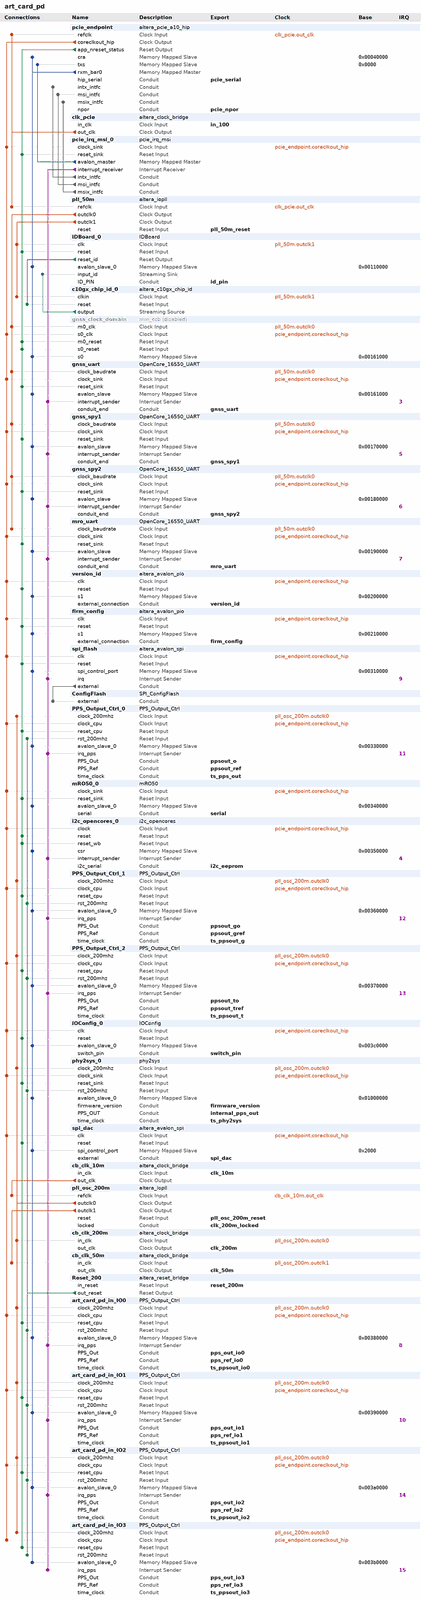
[diagram p0: system contents, whole]
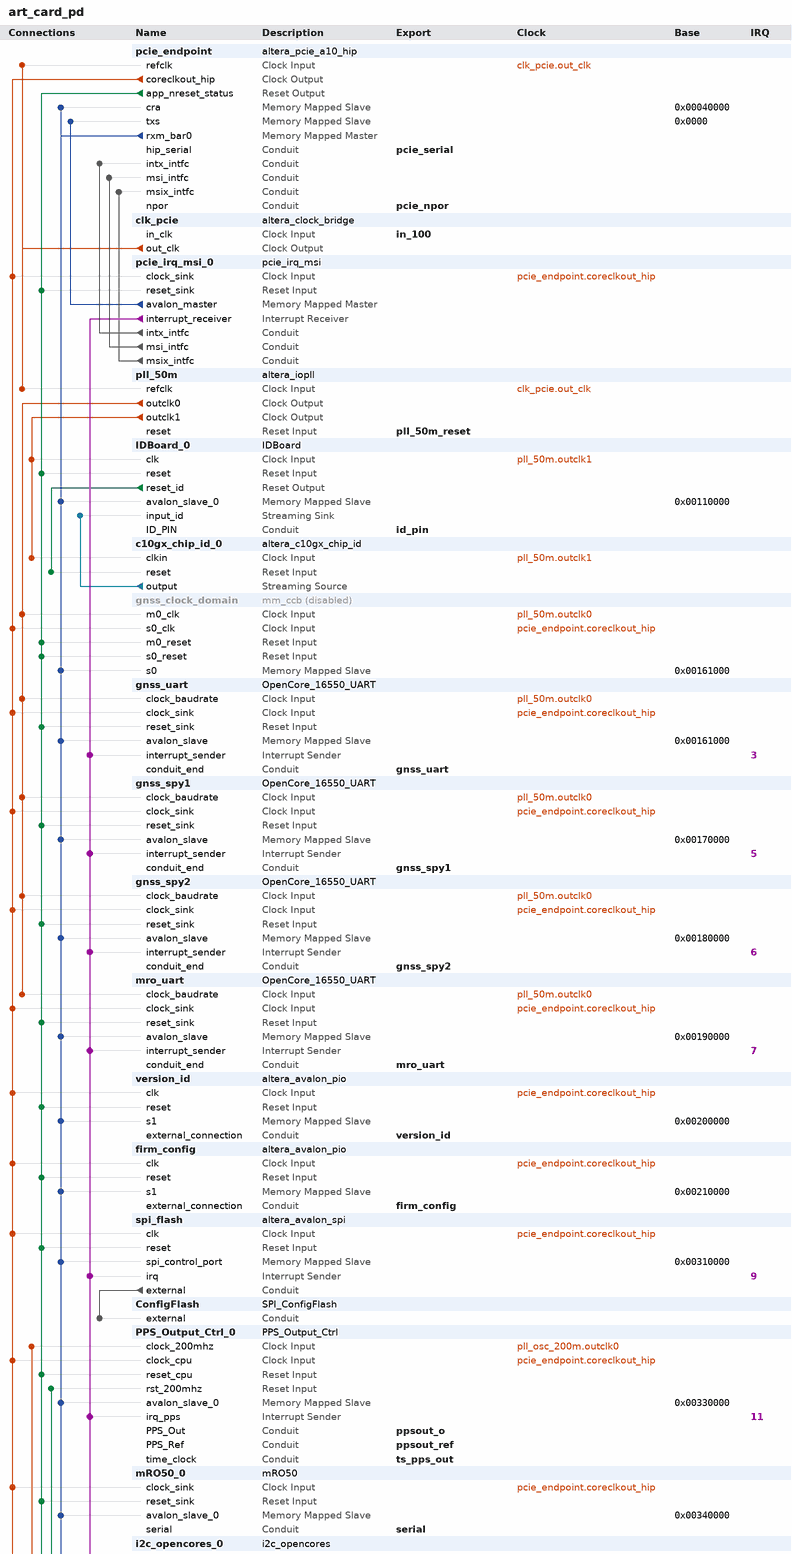
[diagram p1: system contents, upper part]
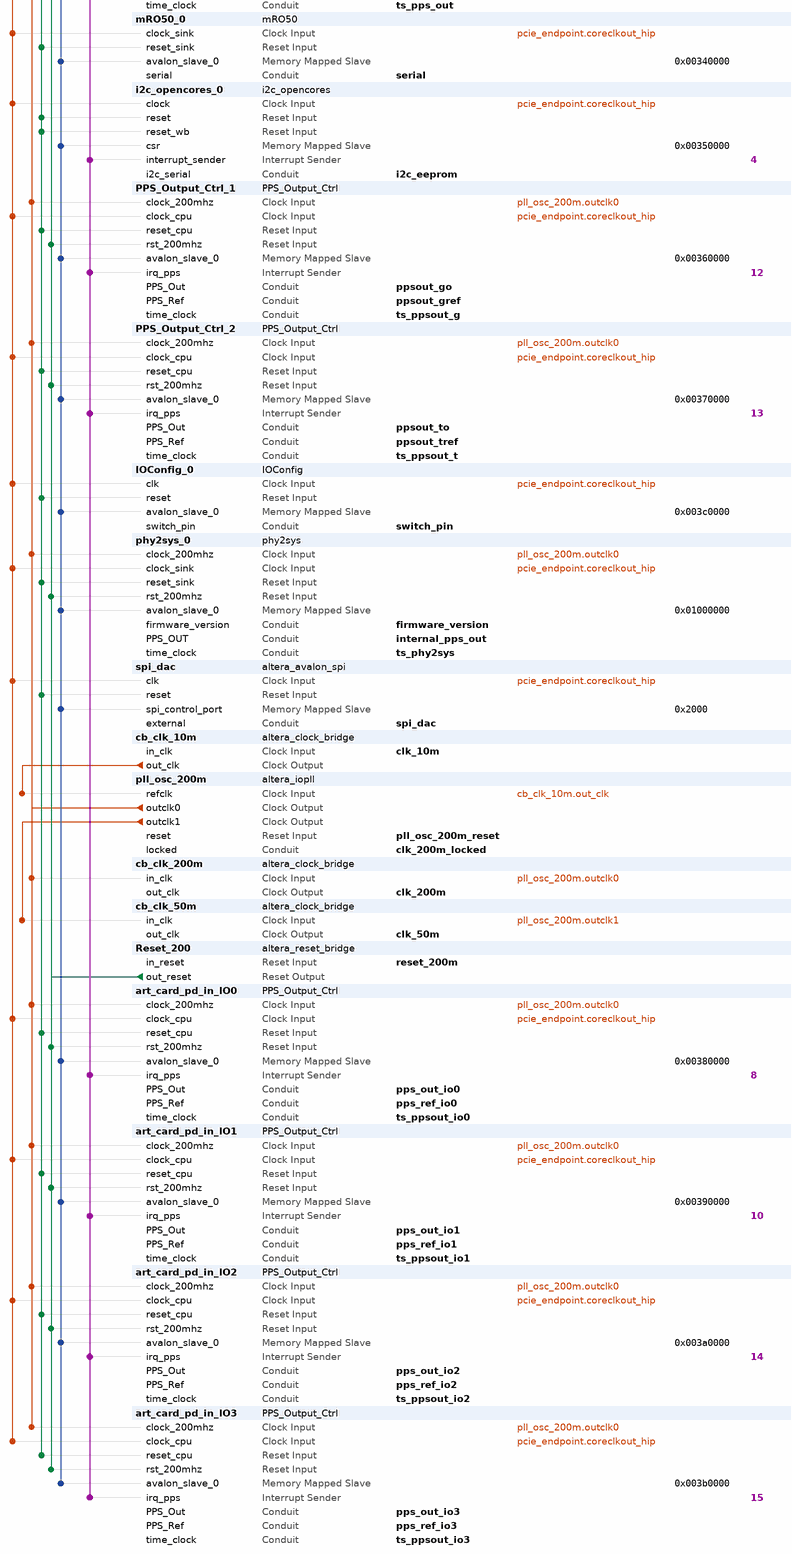
[diagram p2: system contents, lower part]
# Platform Designer (Qsys) system art_card_pd, Cyclone 10 GX 10CX220YF672I5G
# Parameters at their usual value, and those the tool derives, are not listed.
package require -exact qsys 1.0
create_system art_card_pd
set_project_property DEVICE_FAMILY {Cyclone 10 GX}
set_project_property DEVICE 10CX220YF672I5G

add_component pcie_endpoint ip/art_card_pd/art_card_pd_pcie_a10_hip_0.ip altera_pcie_a10_hip pcie_endpoint 20.1.0
load_component pcie_endpoint
set_component_parameter_value interface_type_hwtcl Avalon-MM
set_component_parameter_value force_tag_checking_on_hwtcl 0
set_component_parameter_value wrala_hwtcl 4
set_component_parameter_value device_family {Cyclone 10 GX}
set_component_parameter_value base_device NIGHTFURY1
set_component_parameter_value part_trait_device 10CX220YF672I5G
set_component_parameter_value avmm_addr_width_hwtcl 64
set_component_parameter_value cg_enable_advanced_interrupt_hwtcl 1
set_component_parameter_value cg_enable_a2p_interrupt_hwtcl 0
set_component_parameter_value enable_hip_status_for_avmm_hwtcl 0
set_component_parameter_value internal_controller_hwtcl 1
set_component_parameter_value enable_rxm_burst_hwtcl 0
set_component_parameter_value extended_tag_support_hwtcl 0
set_component_parameter_value user_txs_addr_width_hwtcl 32
set_component_parameter_value cg_a2p_addr_map_pass_thru_bits_hwtcl 12
set_component_parameter_value rx_buffer_credit_alloc_hwtcl Balanced
set_component_parameter_value rx_cred_ctl_param_hwtcl 0
set_component_parameter_value enable_avst_reset_hwtcl 1
set_component_parameter_value cseb_config_bypass_gui_hwtcl 0
set_component_parameter_value cseb_autonomous_hwtcl 0
set_component_parameter_value speed_change_hwtcl 0
set_component_parameter_value xcvr_reconfig_hwtcl 0
set_component_parameter_value export_fpll_output_to_top_level_hwtcl 0
set_component_parameter_value export_phy_input_to_top_level_hwtcl 0
set_component_parameter_value enable_lmi_hwtcl 0
set_component_parameter_value adme_enable_hwtcl 0
set_component_parameter_value enable_devkit_conduit_hwtcl 0
set_component_parameter_value enable_skp_det 0
set_component_parameter_value dis_adapt 0
set_component_parameter_value enable_msft_pipen1b_hwtcl 0
set_component_parameter_value DEBUG_WIDTH 16
set_component_parameter_value enable_ppm_detector_settings_hwtcl 0
set_component_parameter_value select_design_example_hwtcl PIO
set_component_parameter_value enable_example_design_qii_hwtcl 1
set_component_parameter_value enable_example_design_sim_hwtcl 1
set_component_parameter_value enable_g3_bypass_equlz_rp_sim_hwtcl 0
set_component_parameter_value enable_example_design_synth_hwtcl 1
set_component_parameter_value enable_example_design_tb_hwtcl 1
set_component_parameter_value apps_type_hwtcl 0
set_component_parameter_value select_design_example_rtl_lang_hwtcl Verilog
set_component_parameter_value targeted_devkit_hwtcl {Arria 10 GX FPGA Development Kit}
set_component_parameter_value bar0_type_hwtcl {32-bit non-prefetchable memory}
set_component_parameter_value bar0_address_width_hwtcl 16
set_component_parameter_value bar1_type_hwtcl Disabled
set_component_parameter_value bar1_address_width_hwtcl 0
set_component_parameter_value bar2_type_hwtcl Disabled
set_component_parameter_value bar2_address_width_hwtcl 8
set_component_parameter_value bar3_type_hwtcl Disabled
set_component_parameter_value bar3_address_width_hwtcl 0
set_component_parameter_value eco_fb332688_dis_hwtcl 0
set_component_parameter_value vendor_id_hwtcl 6871
set_component_parameter_value device_id_hwtcl 40960
set_component_parameter_value pf0_vf_device_id_hwtcl 0
set_component_parameter_value revision_id_hwtcl 5
set_component_parameter_value class_code_hwtcl 16711680
set_component_parameter_value pf0_subclass_code_hwtcl 0
set_component_parameter_value pf0_pci_prog_intfc_byte_hwtcl 0
set_component_parameter_value subsystem_vendor_id_hwtcl 6871
set_component_parameter_value subsystem_device_id_hwtcl 40960
set_component_parameter_value pf0_vf_subsystem_device_id_hwtcl 0
set_component_parameter_value maximum_payload_size_hwtcl 128
set_component_parameter_value completion_timeout_hwtcl ABCD
set_component_parameter_value advance_error_reporting_hwtcl 0
set_component_parameter_value ecrc_check_capable_hwtcl 0
set_component_parameter_value ecrc_gen_capable_hwtcl 0
set_component_parameter_value slot_clock_cfg_hwtcl 1
set_component_parameter_value msi_multi_message_capable_hwtcl 16
set_component_parameter_value vsec_id_hwtcl 6871
set_component_parameter_value vsec_cap_hwtcl 0
set_component_parameter_value user_id_hwtcl 0
set_component_parameter_value msix_table_size_hwtcl 3
set_component_parameter_value msix_table_bir_hwtcl 3
set_component_parameter_value msix_pba_offset_hwtcl 8192
set_component_parameter_value msix_pba_bir_hwtcl 3
set_component_parameter_value gen3_coeff_1_hwtcl 8
set_component_parameter_value bfm_drive_interface_clk_hwtcl 1
set_component_parameter_value bfm_drive_interface_npor_hwtcl 1
set_component_parameter_value bfm_drive_interface_pipe_hwtcl 1
set_component_parameter_value bfm_drive_interface_control_hwtcl 1
set_component_parameter_value reserved_debug_hwtcl 0
set_component_parameter_value sriov2_en 1
set_component_parameter_value virtio_visible 0
set_component_parameter_value enable_nobar_slection_hwtcl 0
set_component_parameter_value enable_custom_features_hwtcl 0
set_component_parameter_value pf0_extra_bar_present_hwtcl 0
set_component_parameter_value pf0_extra_bar_size_hwtcl 12
set_component_parameter_value devhide_support_hwtcl 0
set_component_parameter_value device_embedded_ep_support_hwtcl 0
set_component_parameter_value total_pf_count_hwtcl 1
set_component_parameter_value pf0_vf_count_user_hwtcl 0
set_component_parameter_value pf1_vf_count_user_hwtcl 0
set_component_parameter_value pf2_vf_count_user_hwtcl 0
set_component_parameter_value pf3_vf_count_user_hwtcl 0
set_component_parameter_value system_page_sizes_supported_hwtcl 1363
set_component_parameter_value sr_iov_support_hwtcl 0
set_component_parameter_value include_virtio_capabilities_hwtcl 0
set_component_parameter_value enable_alternate_link_list_hwtcl 0
set_component_parameter_value ari_support_hwtcl 0
set_component_parameter_value flr_capability_user_hwtcl 0
set_component_parameter_value pf0_virtio_capability_present_hwtcl 0
set_component_parameter_value pf0_virtio_device_specific_cap_present_hwtcl 0
set_component_parameter_value pf0_virtio_cmn_config_bar_indicator_hwtcl 0
set_component_parameter_value pf0_virtio_cmn_config_bar_offset_hwtcl 0
set_component_parameter_value pf0_virtio_cmn_config_structure_length_hwtcl 0
set_component_parameter_value pf0_virtio_notification_bar_indicator_hwtcl 0
set_component_parameter_value pf0_virtio_notification_bar_offset_hwtcl 0
set_component_parameter_value pf0_virtio_notification_structure_length_hwtcl 0
set_component_parameter_value pf0_virtio_notify_off_multiplier_hwtcl 0
set_component_parameter_value pf0_virtio_isrstatus_bar_indicator_hwtcl 0
set_component_parameter_value pf0_virtio_isrstatus_bar_offset_hwtcl 0
set_component_parameter_value pf0_virtio_isrstatus_structure_length_hwtcl 0
set_component_parameter_value pf0_virtio_devspecific_bar_indicator_hwtcl 0
set_component_parameter_value pf0_virtio_devspecific_bar_offset_hwtcl 0
set_component_parameter_value pf0_virtio_devspecific_structure_length_hwtcl 0
set_component_parameter_value pf0_virtio_pciconfig_access_bar_indicator_hwtcl 0
set_component_parameter_value pf0_virtio_pciconfig_access_bar_offset_hwtcl 0
set_component_parameter_value pf0_virtio_pciconfig_access_structure_length_hwtcl 0
set_component_parameter_value pf1_virtio_capability_present_hwtcl 0
set_component_parameter_value pf1_virtio_device_specific_cap_present_hwtcl 0
set_component_parameter_value pf1_virtio_cmn_config_bar_indicator_hwtcl 0
set_component_parameter_value pf1_virtio_cmn_config_bar_offset_hwtcl 0
set_component_parameter_value pf1_virtio_cmn_config_structure_length_hwtcl 0
set_component_parameter_value pf1_virtio_notification_bar_indicator_hwtcl 0
set_component_parameter_value pf1_virtio_notification_bar_offset_hwtcl 0
set_component_parameter_value pf1_virtio_notification_structure_length_hwtcl 0
set_component_parameter_value pf1_virtio_notify_off_multiplier_hwtcl 0
set_component_parameter_value pf1_virtio_isrstatus_bar_indicator_hwtcl 0
set_component_parameter_value pf1_virtio_isrstatus_bar_offset_hwtcl 0
set_component_parameter_value pf1_virtio_isrstatus_structure_length_hwtcl 0
set_component_parameter_value pf1_virtio_devspecific_bar_indicator_hwtcl 0
set_component_parameter_value pf1_virtio_devspecific_bar_offset_hwtcl 0
set_component_parameter_value pf1_virtio_devspecific_structure_length_hwtcl 0
set_component_parameter_value pf1_virtio_pciconfig_access_bar_indicator_hwtcl 0
set_component_parameter_value pf1_virtio_pciconfig_access_bar_offset_hwtcl 0
set_component_parameter_value pf1_virtio_pciconfig_access_structure_length_hwtcl 0
set_component_parameter_value pf2_virtio_capability_present_hwtcl 0
set_component_parameter_value pf2_virtio_device_specific_cap_present_hwtcl 0
set_component_parameter_value pf2_virtio_cmn_config_bar_indicator_hwtcl 0
set_component_parameter_value pf2_virtio_cmn_config_bar_offset_hwtcl 0
set_component_parameter_value pf2_virtio_cmn_config_structure_length_hwtcl 0
set_component_parameter_value pf2_virtio_notification_bar_indicator_hwtcl 0
set_component_parameter_value pf2_virtio_notification_bar_offset_hwtcl 0
set_component_parameter_value pf2_virtio_notification_structure_length_hwtcl 0
set_component_parameter_value pf2_virtio_notify_off_multiplier_hwtcl 0
set_component_parameter_value pf2_virtio_isrstatus_bar_indicator_hwtcl 0
set_component_parameter_value pf2_virtio_isrstatus_bar_offset_hwtcl 0
set_component_parameter_value pf2_virtio_isrstatus_structure_length_hwtcl 0
set_component_parameter_value pf2_virtio_devspecific_bar_indicator_hwtcl 0
set_component_parameter_value pf2_virtio_devspecific_bar_offset_hwtcl 0
set_component_parameter_value pf2_virtio_devspecific_structure_length_hwtcl 0
set_component_parameter_value pf2_virtio_pciconfig_access_bar_indicator_hwtcl 0
set_component_parameter_value pf2_virtio_pciconfig_access_bar_offset_hwtcl 0
set_component_parameter_value pf2_virtio_pciconfig_access_structure_length_hwtcl 0
set_component_parameter_value pf3_virtio_capability_present_hwtcl 0
set_component_parameter_value pf3_virtio_device_specific_cap_present_hwtcl 0
set_component_parameter_value pf3_virtio_cmn_config_bar_indicator_hwtcl 0
set_component_parameter_value pf3_virtio_cmn_config_bar_offset_hwtcl 0
set_component_parameter_value pf3_virtio_cmn_config_structure_length_hwtcl 0
set_component_parameter_value pf3_virtio_notification_bar_indicator_hwtcl 0
set_component_parameter_value pf3_virtio_notification_bar_offset_hwtcl 0
set_component_parameter_value pf3_virtio_notification_structure_length_hwtcl 0
set_component_parameter_value pf3_virtio_notify_off_multiplier_hwtcl 0
set_component_parameter_value pf3_virtio_isrstatus_bar_indicator_hwtcl 0
set_component_parameter_value pf3_virtio_isrstatus_bar_offset_hwtcl 0
set_component_parameter_value pf3_virtio_isrstatus_structure_length_hwtcl 0
set_component_parameter_value pf3_virtio_devspecific_bar_indicator_hwtcl 0
set_component_parameter_value pf3_virtio_devspecific_bar_offset_hwtcl 0
set_component_parameter_value pf3_virtio_devspecific_structure_length_hwtcl 0
set_component_parameter_value pf3_virtio_pciconfig_access_bar_indicator_hwtcl 0
set_component_parameter_value pf3_virtio_pciconfig_access_bar_offset_hwtcl 0
set_component_parameter_value pf3_virtio_pciconfig_access_structure_length_hwtcl 0
set_component_parameter_value pf4_virtio_capability_present_hwtcl 0
set_component_parameter_value pf4_virtio_device_specific_cap_present_hwtcl 0
set_component_parameter_value pf4_virtio_cmn_config_bar_indicator_hwtcl 0
set_component_parameter_value pf4_virtio_cmn_config_bar_offset_hwtcl 0
set_component_parameter_value pf4_virtio_cmn_config_structure_length_hwtcl 0
set_component_parameter_value pf4_virtio_notification_bar_indicator_hwtcl 0
set_component_parameter_value pf4_virtio_notification_bar_offset_hwtcl 0
set_component_parameter_value pf4_virtio_notification_structure_length_hwtcl 0
set_component_parameter_value pf4_virtio_notify_off_multiplier_hwtcl 0
set_component_parameter_value pf4_virtio_isrstatus_bar_indicator_hwtcl 0
set_component_parameter_value pf4_virtio_isrstatus_bar_offset_hwtcl 0
set_component_parameter_value pf4_virtio_isrstatus_structure_length_hwtcl 0
set_component_parameter_value pf4_virtio_devspecific_bar_indicator_hwtcl 0
set_component_parameter_value pf4_virtio_devspecific_bar_offset_hwtcl 0
set_component_parameter_value pf4_virtio_devspecific_structure_length_hwtcl 0
set_component_parameter_value pf4_virtio_pciconfig_access_bar_indicator_hwtcl 0
set_component_parameter_value pf4_virtio_pciconfig_access_bar_offset_hwtcl 0
set_component_parameter_value pf4_virtio_pciconfig_access_structure_length_hwtcl 0
set_component_parameter_value pf5_virtio_capability_present_hwtcl 0
set_component_parameter_value pf5_virtio_device_specific_cap_present_hwtcl 0
set_component_parameter_value pf5_virtio_cmn_config_bar_indicator_hwtcl 0
set_component_parameter_value pf5_virtio_cmn_config_bar_offset_hwtcl 0
set_component_parameter_value pf5_virtio_cmn_config_structure_length_hwtcl 0
set_component_parameter_value pf5_virtio_notification_bar_indicator_hwtcl 0
set_component_parameter_value pf5_virtio_notification_bar_offset_hwtcl 0
set_component_parameter_value pf5_virtio_notification_structure_length_hwtcl 0
set_component_parameter_value pf5_virtio_notify_off_multiplier_hwtcl 0
set_component_parameter_value pf5_virtio_isrstatus_bar_indicator_hwtcl 0
set_component_parameter_value pf5_virtio_isrstatus_bar_offset_hwtcl 0
set_component_parameter_value pf5_virtio_isrstatus_structure_length_hwtcl 0
set_component_parameter_value pf5_virtio_devspecific_bar_indicator_hwtcl 0
set_component_parameter_value pf5_virtio_devspecific_bar_offset_hwtcl 0
set_component_parameter_value pf5_virtio_devspecific_structure_length_hwtcl 0
set_component_parameter_value pf5_virtio_pciconfig_access_bar_indicator_hwtcl 0
set_component_parameter_value pf5_virtio_pciconfig_access_bar_offset_hwtcl 0
set_component_parameter_value pf5_virtio_pciconfig_access_structure_length_hwtcl 0
set_component_parameter_value pf6_virtio_capability_present_hwtcl 0
set_component_parameter_value pf6_virtio_device_specific_cap_present_hwtcl 0
set_component_parameter_value pf6_virtio_cmn_config_bar_indicator_hwtcl 0
set_component_parameter_value pf6_virtio_cmn_config_bar_offset_hwtcl 0
set_component_parameter_value pf6_virtio_cmn_config_structure_length_hwtcl 0
set_component_parameter_value pf6_virtio_notification_bar_indicator_hwtcl 0
set_component_parameter_value pf6_virtio_notification_bar_offset_hwtcl 0
set_component_parameter_value pf6_virtio_notification_structure_length_hwtcl 0
set_component_parameter_value pf6_virtio_notify_off_multiplier_hwtcl 0
set_component_parameter_value pf6_virtio_isrstatus_bar_indicator_hwtcl 0
set_component_parameter_value pf6_virtio_isrstatus_bar_offset_hwtcl 0
set_component_parameter_value pf6_virtio_isrstatus_structure_length_hwtcl 0
set_component_parameter_value pf6_virtio_devspecific_bar_indicator_hwtcl 0
set_component_parameter_value pf6_virtio_devspecific_bar_offset_hwtcl 0
set_component_parameter_value pf6_virtio_devspecific_structure_length_hwtcl 0
set_component_parameter_value pf6_virtio_pciconfig_access_bar_indicator_hwtcl 0
set_component_parameter_value pf6_virtio_pciconfig_access_bar_offset_hwtcl 0
set_component_parameter_value pf6_virtio_pciconfig_access_structure_length_hwtcl 0
set_component_parameter_value pf7_virtio_capability_present_hwtcl 0
set_component_parameter_value pf7_virtio_device_specific_cap_present_hwtcl 0
set_component_parameter_value pf7_virtio_cmn_config_bar_indicator_hwtcl 0
set_component_parameter_value pf7_virtio_cmn_config_bar_offset_hwtcl 0
set_component_parameter_value pf7_virtio_cmn_config_structure_length_hwtcl 0
set_component_parameter_value pf7_virtio_notification_bar_indicator_hwtcl 0
set_component_parameter_value pf7_virtio_notification_bar_offset_hwtcl 0
set_component_parameter_value pf7_virtio_notification_structure_length_hwtcl 0
set_component_parameter_value pf7_virtio_notify_off_multiplier_hwtcl 0
set_component_parameter_value pf7_virtio_isrstatus_bar_indicator_hwtcl 0
set_component_parameter_value pf7_virtio_isrstatus_bar_offset_hwtcl 0
set_component_parameter_value pf7_virtio_isrstatus_structure_length_hwtcl 0
set_component_parameter_value pf7_virtio_devspecific_bar_indicator_hwtcl 0
set_component_parameter_value pf7_virtio_devspecific_bar_offset_hwtcl 0
set_component_parameter_value pf7_virtio_devspecific_structure_length_hwtcl 0
set_component_parameter_value pf7_virtio_pciconfig_access_bar_indicator_hwtcl 0
set_component_parameter_value pf7_virtio_pciconfig_access_bar_offset_hwtcl 0
set_component_parameter_value pf7_virtio_pciconfig_access_structure_length_hwtcl 0
set_component_parameter_value pf0vf_virtio_capability_present_hwtcl 0
set_component_parameter_value pf0vf_virtio_device_specific_cap_present_hwtcl 0
set_component_parameter_value pf0vf_virtio_cmn_config_bar_indicator_hwtcl 0
set_component_parameter_value pf0vf_virtio_cmn_config_bar_offset_hwtcl 0
set_component_parameter_value pf0vf_virtio_cmn_config_structure_length_hwtcl 0
set_component_parameter_value pf0vf_virtio_notification_bar_indicator_hwtcl 0
set_component_parameter_value pf0vf_virtio_notification_bar_offset_hwtcl 0
set_component_parameter_value pf0vf_virtio_notification_structure_length_hwtcl 0
set_component_parameter_value pf0vf_virtio_notify_off_multiplier_hwtcl 0
set_component_parameter_value pf0vf_virtio_isrstatus_bar_indicator_hwtcl 0
set_component_parameter_value pf0vf_virtio_isrstatus_bar_offset_hwtcl 0
set_component_parameter_value pf0vf_virtio_isrstatus_structure_length_hwtcl 0
set_component_parameter_value pf0vf_virtio_devspecific_bar_indicator_hwtcl 0
set_component_parameter_value pf0vf_virtio_devspecific_bar_offset_hwtcl 0
set_component_parameter_value pf0vf_virtio_devspecific_structure_length_hwtcl 0
set_component_parameter_value pf0vf_virtio_pciconfig_access_bar_indicator_hwtcl 0
set_component_parameter_value pf0vf_virtio_pciconfig_access_bar_offset_hwtcl 0
set_component_parameter_value pf0vf_virtio_pciconfig_access_structure_length_hwtcl 0
set_component_parameter_value pf1vf_virtio_capability_present_hwtcl 0
set_component_parameter_value pf1vf_virtio_device_specific_cap_present_hwtcl 0
set_component_parameter_value pf1vf_virtio_cmn_config_bar_indicator_hwtcl 0
set_component_parameter_value pf1vf_virtio_cmn_config_bar_offset_hwtcl 0
set_component_parameter_value pf1vf_virtio_cmn_config_structure_length_hwtcl 0
set_component_parameter_value pf1vf_virtio_notification_bar_indicator_hwtcl 0
set_component_parameter_value pf1vf_virtio_notification_bar_offset_hwtcl 0
set_component_parameter_value pf1vf_virtio_notification_structure_length_hwtcl 0
set_component_parameter_value pf1vf_virtio_notify_off_multiplier_hwtcl 0
set_component_parameter_value pf1vf_virtio_isrstatus_bar_indicator_hwtcl 0
set_component_parameter_value pf1vf_virtio_isrstatus_bar_offset_hwtcl 0
set_component_parameter_value pf1vf_virtio_isrstatus_structure_length_hwtcl 0
set_component_parameter_value pf1vf_virtio_devspecific_bar_indicator_hwtcl 0
set_component_parameter_value pf1vf_virtio_devspecific_bar_offset_hwtcl 0
set_component_parameter_value pf1vf_virtio_devspecific_structure_length_hwtcl 0
set_component_parameter_value pf1vf_virtio_pciconfig_access_bar_indicator_hwtcl 0
set_component_parameter_value pf1vf_virtio_pciconfig_access_bar_offset_hwtcl 0
set_component_parameter_value pf1vf_virtio_pciconfig_access_structure_length_hwtcl 0
set_component_parameter_value pf2vf_virtio_capability_present_hwtcl 0
set_component_parameter_value pf2vf_virtio_device_specific_cap_present_hwtcl 0
set_component_parameter_value pf2vf_virtio_cmn_config_bar_indicator_hwtcl 0
set_component_parameter_value pf2vf_virtio_cmn_config_bar_offset_hwtcl 0
set_component_parameter_value pf2vf_virtio_cmn_config_structure_length_hwtcl 0
set_component_parameter_value pf2vf_virtio_notification_bar_indicator_hwtcl 0
set_component_parameter_value pf2vf_virtio_notification_bar_offset_hwtcl 0
set_component_parameter_value pf2vf_virtio_notification_structure_length_hwtcl 0
set_component_parameter_value pf2vf_virtio_notify_off_multiplier_hwtcl 0
set_component_parameter_value pf2vf_virtio_isrstatus_bar_indicator_hwtcl 0
set_component_parameter_value pf2vf_virtio_isrstatus_bar_offset_hwtcl 0
set_component_parameter_value pf2vf_virtio_isrstatus_structure_length_hwtcl 0
set_component_parameter_value pf2vf_virtio_devspecific_bar_indicator_hwtcl 0
set_component_parameter_value pf2vf_virtio_devspecific_bar_offset_hwtcl 0
set_component_parameter_value pf2vf_virtio_devspecific_structure_length_hwtcl 0
set_component_parameter_value pf2vf_virtio_pciconfig_access_bar_indicator_hwtcl 0
set_component_parameter_value pf2vf_virtio_pciconfig_access_bar_offset_hwtcl 0
set_component_parameter_value pf2vf_virtio_pciconfig_access_structure_length_hwtcl 0
set_component_parameter_value pf3vf_virtio_capability_present_hwtcl 0
set_component_parameter_value pf3vf_virtio_device_specific_cap_present_hwtcl 0
set_component_parameter_value pf3vf_virtio_cmn_config_bar_indicator_hwtcl 0
set_component_parameter_value pf3vf_virtio_cmn_config_bar_offset_hwtcl 0
set_component_parameter_value pf3vf_virtio_cmn_config_structure_length_hwtcl 0
set_component_parameter_value pf3vf_virtio_notification_bar_indicator_hwtcl 0
set_component_parameter_value pf3vf_virtio_notification_bar_offset_hwtcl 0
set_component_parameter_value pf3vf_virtio_notification_structure_length_hwtcl 0
set_component_parameter_value pf3vf_virtio_notify_off_multiplier_hwtcl 0
set_component_parameter_value pf3vf_virtio_isrstatus_bar_indicator_hwtcl 0
set_component_parameter_value pf3vf_virtio_isrstatus_bar_offset_hwtcl 0
set_component_parameter_value pf3vf_virtio_isrstatus_structure_length_hwtcl 0
set_component_parameter_value pf3vf_virtio_devspecific_bar_indicator_hwtcl 0
set_component_parameter_value pf3vf_virtio_devspecific_bar_offset_hwtcl 0
set_component_parameter_value pf3vf_virtio_devspecific_structure_length_hwtcl 0
set_component_parameter_value pf3vf_virtio_pciconfig_access_bar_indicator_hwtcl 0
set_component_parameter_value pf3vf_virtio_pciconfig_access_bar_offset_hwtcl 0
set_component_parameter_value pf3vf_virtio_pciconfig_access_structure_length_hwtcl 0
set_component_parameter_value pf_tph_support_hwtcl 0
set_component_parameter_value pf0_tph_int_mode_support_hwtcl 0
set_component_parameter_value pf0_tph_dev_specific_mode_support_hwtcl 0
set_component_parameter_value pf0_tph_st_table_location_hwtcl 0
set_component_parameter_value pf0_tph_st_table_size_hwtcl 63
set_component_parameter_value pf1_tph_int_mode_support_hwtcl 0
set_component_parameter_value pf1_tph_dev_specific_mode_support_hwtcl 0
set_component_parameter_value pf1_tph_st_table_location_hwtcl 0
set_component_parameter_value pf1_tph_st_table_size_hwtcl 63
set_component_parameter_value pf2_tph_int_mode_support_hwtcl 0
set_component_parameter_value pf2_tph_dev_specific_mode_support_hwtcl 0
set_component_parameter_value pf2_tph_st_table_location_hwtcl 0
set_component_parameter_value pf2_tph_st_table_size_hwtcl 63
set_component_parameter_value pf3_tph_int_mode_support_hwtcl 0
set_component_parameter_value pf3_tph_dev_specific_mode_support_hwtcl 0
set_component_parameter_value pf3_tph_st_table_location_hwtcl 0
set_component_parameter_value pf3_tph_st_table_size_hwtcl 63
set_component_parameter_value vf_tph_support_hwtcl 0
set_component_parameter_value pf0_vf_tph_int_mode_support_hwtcl 0
set_component_parameter_value pf0_vf_tph_dev_specific_mode_support_hwtcl 0
set_component_parameter_value pf0_vf_tph_st_table_location_hwtcl 0
set_component_parameter_value pf0_vf_tph_st_table_size_hwtcl 63
set_component_parameter_value pf1_vf_tph_int_mode_support_hwtcl 0
set_component_parameter_value pf1_vf_tph_dev_specific_mode_support_hwtcl 0
set_component_parameter_value pf1_vf_tph_st_table_location_hwtcl 0
set_component_parameter_value pf1_vf_tph_st_table_size_hwtcl 63
set_component_parameter_value pf2_vf_tph_int_mode_support_hwtcl 0
set_component_parameter_value pf2_vf_tph_dev_specific_mode_support_hwtcl 0
set_component_parameter_value pf2_vf_tph_st_table_location_hwtcl 0
set_component_parameter_value pf2_vf_tph_st_table_size_hwtcl 63
set_component_parameter_value pf3_vf_tph_int_mode_support_hwtcl 0
set_component_parameter_value pf3_vf_tph_dev_specific_mode_support_hwtcl 0
set_component_parameter_value pf3_vf_tph_st_table_location_hwtcl 0
set_component_parameter_value pf3_vf_tph_st_table_size_hwtcl 63
set_component_parameter_value pf_ats_support_hwtcl 0
set_component_parameter_value pf0_ats_invalidate_queue_depth_hwtcl 0
set_component_parameter_value pf1_ats_invalidate_queue_depth_hwtcl 0
set_component_parameter_value pf2_ats_invalidate_queue_depth_hwtcl 0
set_component_parameter_value pf3_ats_invalidate_queue_depth_hwtcl 0
set_component_parameter_value vf_ats_support_hwtcl 0
set_component_parameter_value pf0_bar0_present_hwtcl 1
set_component_parameter_value pf0_bar1_present_hwtcl 0
set_component_parameter_value pf0_bar2_present_hwtcl 0
set_component_parameter_value pf0_bar3_present_hwtcl 0
set_component_parameter_value pf0_bar4_present_hwtcl 0
set_component_parameter_value pf0_bar5_present_hwtcl 0
set_component_parameter_value pf0_exprom_bar_present_hwtcl 0
set_component_parameter_value pf0_bar0_type_hwtcl 1
set_component_parameter_value pf0_bar2_type_hwtcl 1
set_component_parameter_value pf0_bar4_type_hwtcl 1
set_component_parameter_value pf0_bar0_prefetchable_hwtcl 1
set_component_parameter_value pf0_bar1_prefetchable_hwtcl 1
set_component_parameter_value pf0_bar2_prefetchable_hwtcl 1
set_component_parameter_value pf0_bar3_prefetchable_hwtcl 1
set_component_parameter_value pf0_bar4_prefetchable_hwtcl 1
set_component_parameter_value pf0_bar5_prefetchable_hwtcl 1
set_component_parameter_value pf0_bar0_size_hwtcl 12
set_component_parameter_value pf0_bar1_size_hwtcl 12
set_component_parameter_value pf0_bar2_size_hwtcl 12
set_component_parameter_value pf0_bar3_size_hwtcl 12
set_component_parameter_value pf0_bar4_size_hwtcl 12
set_component_parameter_value pf0_bar5_size_hwtcl 12
set_component_parameter_value pf0_exprom_bar_size_hwtcl 12
set_component_parameter_value pf0_vf_bar0_present_hwtcl 0
set_component_parameter_value pf0_vf_bar1_present_hwtcl 0
set_component_parameter_value pf0_vf_bar2_present_hwtcl 0
set_component_parameter_value pf0_vf_bar3_present_hwtcl 0
set_component_parameter_value pf0_vf_bar4_present_hwtcl 0
set_component_parameter_value pf0_vf_bar5_present_hwtcl 0
set_component_parameter_value pf0_vf_bar0_type_hwtcl 1
set_component_parameter_value pf0_vf_bar2_type_hwtcl 1
set_component_parameter_value pf0_vf_bar4_type_hwtcl 1
set_component_parameter_value pf0_vf_bar0_prefetchable_hwtcl 1
set_component_parameter_value pf0_vf_bar1_prefetchable_hwtcl 1
set_component_parameter_value pf0_vf_bar2_prefetchable_hwtcl 1
set_component_parameter_value pf0_vf_bar3_prefetchable_hwtcl 1
set_component_parameter_value pf0_vf_bar4_prefetchable_hwtcl 1
set_component_parameter_value pf0_vf_bar5_prefetchable_hwtcl 1
set_component_parameter_value pf0_vf_bar0_size_hwtcl 12
set_component_parameter_value pf0_vf_bar1_size_hwtcl 12
set_component_parameter_value pf0_vf_bar2_size_hwtcl 12
set_component_parameter_value pf0_vf_bar3_size_hwtcl 12
set_component_parameter_value pf0_vf_bar4_size_hwtcl 12
set_component_parameter_value pf0_vf_bar5_size_hwtcl 12
set_component_parameter_value pf1_bar0_present_hwtcl 0
set_component_parameter_value pf1_bar1_present_hwtcl 0
set_component_parameter_value pf1_bar2_present_hwtcl 0
set_component_parameter_value pf1_bar3_present_hwtcl 0
set_component_parameter_value pf1_bar4_present_hwtcl 0
set_component_parameter_value pf1_bar5_present_hwtcl 0
set_component_parameter_value pf1_exprom_bar_present_hwtcl 0
set_component_parameter_value pf1_bar0_type_hwtcl 1
set_component_parameter_value pf1_bar2_type_hwtcl 1
set_component_parameter_value pf1_bar4_type_hwtcl 1
set_component_parameter_value pf1_bar0_prefetchable_hwtcl 1
set_component_parameter_value pf1_bar1_prefetchable_hwtcl 1
set_component_parameter_value pf1_bar2_prefetchable_hwtcl 1
set_component_parameter_value pf1_bar3_prefetchable_hwtcl 1
set_component_parameter_value pf1_bar4_prefetchable_hwtcl 1
set_component_parameter_value pf1_bar5_prefetchable_hwtcl 1
set_component_parameter_value pf1_bar0_size_hwtcl 12
set_component_parameter_value pf1_bar1_size_hwtcl 12
set_component_parameter_value pf1_bar2_size_hwtcl 12
set_component_parameter_value pf1_bar3_size_hwtcl 12
set_component_parameter_value pf1_bar4_size_hwtcl 12
set_component_parameter_value pf1_bar5_size_hwtcl 12
set_component_parameter_value pf1_exprom_bar_size_hwtcl 12
set_component_parameter_value pf1_vf_bar0_present_hwtcl 0
set_component_parameter_value pf1_vf_bar1_present_hwtcl 0
set_component_parameter_value pf1_vf_bar2_present_hwtcl 0
set_component_parameter_value pf1_vf_bar3_present_hwtcl 0
set_component_parameter_value pf1_vf_bar4_present_hwtcl 0
set_component_parameter_value pf1_vf_bar5_present_hwtcl 0
set_component_parameter_value pf1_vf_bar0_type_hwtcl 1
set_component_parameter_value pf1_vf_bar2_type_hwtcl 1
set_component_parameter_value pf1_vf_bar4_type_hwtcl 1
set_component_parameter_value pf1_vf_bar0_prefetchable_hwtcl 1
set_component_parameter_value pf1_vf_bar1_prefetchable_hwtcl 1
set_component_parameter_value pf1_vf_bar2_prefetchable_hwtcl 1
set_component_parameter_value pf1_vf_bar3_prefetchable_hwtcl 1
set_component_parameter_value pf1_vf_bar4_prefetchable_hwtcl 1
set_component_parameter_value pf1_vf_bar5_prefetchable_hwtcl 1
set_component_parameter_value pf1_vf_bar0_size_hwtcl 12
set_component_parameter_value pf1_vf_bar1_size_hwtcl 12
set_component_parameter_value pf1_vf_bar2_size_hwtcl 12
set_component_parameter_value pf1_vf_bar3_size_hwtcl 12
set_component_parameter_value pf1_vf_bar4_size_hwtcl 12
set_component_parameter_value pf1_vf_bar5_size_hwtcl 12
set_component_parameter_value pf2_bar0_present_hwtcl 0
set_component_parameter_value pf2_bar1_present_hwtcl 0
set_component_parameter_value pf2_bar2_present_hwtcl 0
set_component_parameter_value pf2_bar3_present_hwtcl 0
set_component_parameter_value pf2_bar4_present_hwtcl 0
set_component_parameter_value pf2_bar5_present_hwtcl 0
set_component_parameter_value pf2_exprom_bar_present_hwtcl 0
set_component_parameter_value pf2_bar0_type_hwtcl 1
set_component_parameter_value pf2_bar2_type_hwtcl 1
set_component_parameter_value pf2_bar4_type_hwtcl 1
set_component_parameter_value pf2_bar0_prefetchable_hwtcl 1
set_component_parameter_value pf2_bar1_prefetchable_hwtcl 1
set_component_parameter_value pf2_bar2_prefetchable_hwtcl 1
set_component_parameter_value pf2_bar3_prefetchable_hwtcl 1
set_component_parameter_value pf2_bar4_prefetchable_hwtcl 1
set_component_parameter_value pf2_bar5_prefetchable_hwtcl 1
set_component_parameter_value pf2_bar0_size_hwtcl 12
set_component_parameter_value pf2_bar1_size_hwtcl 12
set_component_parameter_value pf2_bar2_size_hwtcl 12
set_component_parameter_value pf2_bar3_size_hwtcl 12
set_component_parameter_value pf2_bar4_size_hwtcl 12
set_component_parameter_value pf2_bar5_size_hwtcl 12
set_component_parameter_value pf2_exprom_bar_size_hwtcl 12
set_component_parameter_value pf2_vf_bar0_present_hwtcl 0
set_component_parameter_value pf2_vf_bar1_present_hwtcl 0
set_component_parameter_value pf2_vf_bar2_present_hwtcl 0
set_component_parameter_value pf2_vf_bar3_present_hwtcl 0
set_component_parameter_value pf2_vf_bar4_present_hwtcl 0
set_component_parameter_value pf2_vf_bar5_present_hwtcl 0
set_component_parameter_value pf2_vf_bar0_type_hwtcl 1
set_component_parameter_value pf2_vf_bar2_type_hwtcl 1
set_component_parameter_value pf2_vf_bar4_type_hwtcl 1
set_component_parameter_value pf2_vf_bar0_prefetchable_hwtcl 1
set_component_parameter_value pf2_vf_bar1_prefetchable_hwtcl 1
set_component_parameter_value pf2_vf_bar2_prefetchable_hwtcl 1
set_component_parameter_value pf2_vf_bar3_prefetchable_hwtcl 1
set_component_parameter_value pf2_vf_bar4_prefetchable_hwtcl 1
set_component_parameter_value pf2_vf_bar5_prefetchable_hwtcl 1
set_component_parameter_value pf2_vf_bar0_size_hwtcl 12
set_component_parameter_value pf2_vf_bar1_size_hwtcl 12
set_component_parameter_value pf2_vf_bar2_size_hwtcl 12
set_component_parameter_value pf2_vf_bar3_size_hwtcl 12
set_component_parameter_value pf2_vf_bar4_size_hwtcl 12
set_component_parameter_value pf2_vf_bar5_size_hwtcl 12
set_component_parameter_value pf3_bar0_present_hwtcl 0
set_component_parameter_value pf3_bar1_present_hwtcl 0
set_component_parameter_value pf3_bar2_present_hwtcl 0
set_component_parameter_value pf3_bar3_present_hwtcl 0
set_component_parameter_value pf3_bar4_present_hwtcl 0
set_component_parameter_value pf3_bar5_present_hwtcl 0
set_component_parameter_value pf3_exprom_bar_present_hwtcl 0
set_component_parameter_value pf3_bar0_type_hwtcl 1
set_component_parameter_value pf3_bar2_type_hwtcl 1
set_component_parameter_value pf3_bar4_type_hwtcl 1
set_component_parameter_value pf3_bar0_prefetchable_hwtcl 1
set_component_parameter_value pf3_bar1_prefetchable_hwtcl 1
set_component_parameter_value pf3_bar2_prefetchable_hwtcl 1
set_component_parameter_value pf3_bar3_prefetchable_hwtcl 1
set_component_parameter_value pf3_bar4_prefetchable_hwtcl 1
set_component_parameter_value pf3_bar5_prefetchable_hwtcl 1
set_component_parameter_value pf3_bar0_size_hwtcl 12
set_component_parameter_value pf3_bar1_size_hwtcl 12
set_component_parameter_value pf3_bar2_size_hwtcl 12
set_component_parameter_value pf3_bar3_size_hwtcl 12
set_component_parameter_value pf3_bar4_size_hwtcl 12
set_component_parameter_value pf3_bar5_size_hwtcl 12
set_component_parameter_value pf3_exprom_bar_size_hwtcl 12
set_component_parameter_value pf3_vf_bar0_present_hwtcl 0
set_component_parameter_value pf3_vf_bar1_present_hwtcl 0
set_component_parameter_value pf3_vf_bar2_present_hwtcl 0
set_component_parameter_value pf3_vf_bar3_present_hwtcl 0
set_component_parameter_value pf3_vf_bar4_present_hwtcl 0
set_component_parameter_value pf3_vf_bar5_present_hwtcl 0
set_component_parameter_value pf3_vf_bar0_type_hwtcl 1
set_component_parameter_value pf3_vf_bar2_type_hwtcl 1
set_component_parameter_value pf3_vf_bar4_type_hwtcl 1
set_component_parameter_value pf3_vf_bar0_prefetchable_hwtcl 1
set_component_parameter_value pf3_vf_bar1_prefetchable_hwtcl 1
set_component_parameter_value pf3_vf_bar2_prefetchable_hwtcl 1
set_component_parameter_value pf3_vf_bar3_prefetchable_hwtcl 1
set_component_parameter_value pf3_vf_bar4_prefetchable_hwtcl 1
set_component_parameter_value pf3_vf_bar5_prefetchable_hwtcl 1
set_component_parameter_value pf3_vf_bar0_size_hwtcl 12
set_component_parameter_value pf3_vf_bar1_size_hwtcl 12
set_component_parameter_value pf3_vf_bar2_size_hwtcl 12
set_component_parameter_value pf3_vf_bar3_size_hwtcl 12
set_component_parameter_value pf3_vf_bar4_size_hwtcl 12
set_component_parameter_value pf3_vf_bar5_size_hwtcl 12
set_component_parameter_value pf4_bar0_present_hwtcl 0
set_component_parameter_value pf4_bar1_present_hwtcl 0
set_component_parameter_value pf4_bar2_present_hwtcl 0
set_component_parameter_value pf4_bar3_present_hwtcl 0
set_component_parameter_value pf4_bar4_present_hwtcl 0
set_component_parameter_value pf4_bar5_present_hwtcl 0
set_component_parameter_value pf4_exprom_bar_present_hwtcl 0
set_component_parameter_value pf4_bar0_type_hwtcl 1
set_component_parameter_value pf4_bar2_type_hwtcl 1
set_component_parameter_value pf4_bar4_type_hwtcl 1
set_component_parameter_value pf4_bar0_prefetchable_hwtcl 1
set_component_parameter_value pf4_bar1_prefetchable_hwtcl 1
set_component_parameter_value pf4_bar2_prefetchable_hwtcl 1
set_component_parameter_value pf4_bar3_prefetchable_hwtcl 1
set_component_parameter_value pf4_bar4_prefetchable_hwtcl 1
set_component_parameter_value pf4_bar5_prefetchable_hwtcl 1
set_component_parameter_value pf4_bar0_size_hwtcl 12
set_component_parameter_value pf4_bar1_size_hwtcl 12
set_component_parameter_value pf4_bar2_size_hwtcl 12
set_component_parameter_value pf4_bar3_size_hwtcl 12
set_component_parameter_value pf4_bar4_size_hwtcl 12
set_component_parameter_value pf4_bar5_size_hwtcl 12
set_component_parameter_value pf4_exprom_bar_size_hwtcl 12
set_component_parameter_value pf5_bar0_present_hwtcl 0
set_component_parameter_value pf5_bar1_present_hwtcl 0
set_component_parameter_value pf5_bar2_present_hwtcl 0
set_component_parameter_value pf5_bar3_present_hwtcl 0
set_component_parameter_value pf5_bar4_present_hwtcl 0
set_component_parameter_value pf5_bar5_present_hwtcl 0
set_component_parameter_value pf5_exprom_bar_present_hwtcl 0
set_component_parameter_value pf5_bar0_type_hwtcl 1
set_component_parameter_value pf5_bar2_type_hwtcl 1
set_component_parameter_value pf5_bar4_type_hwtcl 1
set_component_parameter_value pf5_bar0_prefetchable_hwtcl 1
set_component_parameter_value pf5_bar1_prefetchable_hwtcl 1
set_component_parameter_value pf5_bar2_prefetchable_hwtcl 1
set_component_parameter_value pf5_bar3_prefetchable_hwtcl 1
set_component_parameter_value pf5_bar4_prefetchable_hwtcl 1
set_component_parameter_value pf5_bar5_prefetchable_hwtcl 1
set_component_parameter_value pf5_bar0_size_hwtcl 12
set_component_parameter_value pf5_bar1_size_hwtcl 12
set_component_parameter_value pf5_bar2_size_hwtcl 12
set_component_parameter_value pf5_bar3_size_hwtcl 12
set_component_parameter_value pf5_bar4_size_hwtcl 12
set_component_parameter_value pf5_bar5_size_hwtcl 12
set_component_parameter_value pf5_exprom_bar_size_hwtcl 12
set_component_parameter_value pf6_bar0_present_hwtcl 0
set_component_parameter_value pf6_bar1_present_hwtcl 0
set_component_parameter_value pf6_bar2_present_hwtcl 0
set_component_parameter_value pf6_bar3_present_hwtcl 0
set_component_parameter_value pf6_bar4_present_hwtcl 0
set_component_parameter_value pf6_bar5_present_hwtcl 0
set_component_parameter_value pf6_exprom_bar_present_hwtcl 0
set_component_parameter_value pf6_bar0_type_hwtcl 1
set_component_parameter_value pf6_bar2_type_hwtcl 1
set_component_parameter_value pf6_bar4_type_hwtcl 1
set_component_parameter_value pf6_bar0_prefetchable_hwtcl 1
set_component_parameter_value pf6_bar1_prefetchable_hwtcl 1
set_component_parameter_value pf6_bar2_prefetchable_hwtcl 1
set_component_parameter_value pf6_bar3_prefetchable_hwtcl 1
set_component_parameter_value pf6_bar4_prefetchable_hwtcl 1
set_component_parameter_value pf6_bar5_prefetchable_hwtcl 1
set_component_parameter_value pf6_bar0_size_hwtcl 12
set_component_parameter_value pf6_bar1_size_hwtcl 12
set_component_parameter_value pf6_bar2_size_hwtcl 12
set_component_parameter_value pf6_bar3_size_hwtcl 12
set_component_parameter_value pf6_bar4_size_hwtcl 12
set_component_parameter_value pf6_bar5_size_hwtcl 12
set_component_parameter_value pf6_exprom_bar_size_hwtcl 12
set_component_parameter_value pf7_bar0_present_hwtcl 0
set_component_parameter_value pf7_bar1_present_hwtcl 0
set_component_parameter_value pf7_bar2_present_hwtcl 0
set_component_parameter_value pf7_bar3_present_hwtcl 0
set_component_parameter_value pf7_bar4_present_hwtcl 0
set_component_parameter_value pf7_bar5_present_hwtcl 0
set_component_parameter_value pf7_exprom_bar_present_hwtcl 0
set_component_parameter_value pf7_bar0_type_hwtcl 1
set_component_parameter_value pf7_bar2_type_hwtcl 1
set_component_parameter_value pf7_bar4_type_hwtcl 1
set_component_parameter_value pf7_bar0_prefetchable_hwtcl 1
set_component_parameter_value pf7_bar1_prefetchable_hwtcl 1
set_component_parameter_value pf7_bar2_prefetchable_hwtcl 1
set_component_parameter_value pf7_bar3_prefetchable_hwtcl 1
set_component_parameter_value pf7_bar4_prefetchable_hwtcl 1
set_component_parameter_value pf7_bar5_prefetchable_hwtcl 1
set_component_parameter_value pf7_bar0_size_hwtcl 12
set_component_parameter_value pf7_bar1_size_hwtcl 12
set_component_parameter_value pf7_bar2_size_hwtcl 12
set_component_parameter_value pf7_bar3_size_hwtcl 12
set_component_parameter_value pf7_bar4_size_hwtcl 12
set_component_parameter_value pf7_bar5_size_hwtcl 12
set_component_parameter_value pf7_exprom_bar_size_hwtcl 12
set_component_parameter_value pf1_vendor_id_hwtcl 0
set_component_parameter_value pf1_device_id_hwtcl 0
set_component_parameter_value pf1_vf_device_id_hwtcl 0
set_component_parameter_value pf1_revision_id_hwtcl 0
set_component_parameter_value pf1_class_code_hwtcl 0
set_component_parameter_value pf1_subclass_code_hwtcl 0
set_component_parameter_value pf1_pci_prog_intfc_byte_hwtcl 0
set_component_parameter_value pf1_subsystem_vendor_id_hwtcl 0
set_component_parameter_value pf1_subsystem_device_id_hwtcl 0
set_component_parameter_value pf1_vf_subsystem_device_id_hwtcl 0
set_component_parameter_value pf2_vendor_id_hwtcl 0
set_component_parameter_value pf2_device_id_hwtcl 0
set_component_parameter_value pf2_vf_device_id_hwtcl 0
set_component_parameter_value pf2_revision_id_hwtcl 0
set_component_parameter_value pf2_class_code_hwtcl 0
set_component_parameter_value pf2_subclass_code_hwtcl 0
set_component_parameter_value pf2_pci_prog_intfc_byte_hwtcl 0
set_component_parameter_value pf2_subsystem_vendor_id_hwtcl 0
set_component_parameter_value pf2_subsystem_device_id_hwtcl 0
set_component_parameter_value pf2_vf_subsystem_device_id_hwtcl 0
set_component_parameter_value pf3_vendor_id_hwtcl 0
set_component_parameter_value pf3_device_id_hwtcl 0
set_component_parameter_value pf3_vf_device_id_hwtcl 0
set_component_parameter_value pf3_revision_id_hwtcl 0
set_component_parameter_value pf3_class_code_hwtcl 0
set_component_parameter_value pf3_subclass_code_hwtcl 0
set_component_parameter_value pf3_pci_prog_intfc_byte_hwtcl 0
set_component_parameter_value pf3_subsystem_vendor_id_hwtcl 0
set_component_parameter_value pf3_subsystem_device_id_hwtcl 0
set_component_parameter_value pf3_vf_subsystem_device_id_hwtcl 0
set_component_parameter_value pf4_vendor_id_hwtcl 0
set_component_parameter_value pf4_device_id_hwtcl 0
set_component_parameter_value pf4_vf_device_id_hwtcl 0
set_component_parameter_value pf4_revision_id_hwtcl 0
set_component_parameter_value pf4_class_code_hwtcl 0
set_component_parameter_value pf4_subclass_code_hwtcl 0
set_component_parameter_value pf4_pci_prog_intfc_byte_hwtcl 0
set_component_parameter_value pf4_subsystem_vendor_id_hwtcl 0
set_component_parameter_value pf4_subsystem_device_id_hwtcl 0
set_component_parameter_value pf4_vf_subsystem_device_id_hwtcl 0
set_component_parameter_value pf5_vendor_id_hwtcl 0
set_component_parameter_value pf5_device_id_hwtcl 0
set_component_parameter_value pf5_vf_device_id_hwtcl 0
set_component_parameter_value pf5_revision_id_hwtcl 0
set_component_parameter_value pf5_class_code_hwtcl 0
set_component_parameter_value pf5_subclass_code_hwtcl 0
set_component_parameter_value pf5_pci_prog_intfc_byte_hwtcl 0
set_component_parameter_value pf5_subsystem_vendor_id_hwtcl 0
set_component_parameter_value pf5_subsystem_device_id_hwtcl 0
set_component_parameter_value pf5_vf_subsystem_device_id_hwtcl 0
set_component_parameter_value pf6_vendor_id_hwtcl 0
set_component_parameter_value pf6_device_id_hwtcl 0
set_component_parameter_value pf6_vf_device_id_hwtcl 0
set_component_parameter_value pf6_revision_id_hwtcl 0
set_component_parameter_value pf6_class_code_hwtcl 0
set_component_parameter_value pf6_subclass_code_hwtcl 0
set_component_parameter_value pf6_pci_prog_intfc_byte_hwtcl 0
set_component_parameter_value pf6_subsystem_vendor_id_hwtcl 0
set_component_parameter_value pf6_subsystem_device_id_hwtcl 0
set_component_parameter_value pf6_vf_subsystem_device_id_hwtcl 0
set_component_parameter_value pf7_vendor_id_hwtcl 0
set_component_parameter_value pf7_device_id_hwtcl 0
set_component_parameter_value pf7_vf_device_id_hwtcl 0
set_component_parameter_value pf7_revision_id_hwtcl 0
set_component_parameter_value pf7_class_code_hwtcl 0
set_component_parameter_value pf7_subclass_code_hwtcl 0
set_component_parameter_value pf7_pci_prog_intfc_byte_hwtcl 0
set_component_parameter_value pf7_subsystem_vendor_id_hwtcl 0
set_component_parameter_value pf7_subsystem_device_id_hwtcl 0
set_component_parameter_value pf7_vf_subsystem_device_id_hwtcl 0
set_component_parameter_value pf_msi_support_hwtcl 0
set_component_parameter_value pf0_msi_multi_message_capable_hwtcl 4
set_component_parameter_value pf1_msi_multi_message_capable_hwtcl 4
set_component_parameter_value pf2_msi_multi_message_capable_hwtcl 4
set_component_parameter_value pf3_msi_multi_message_capable_hwtcl 4
set_component_parameter_value pf4_msi_multi_message_capable_hwtcl 4
set_component_parameter_value pf5_msi_multi_message_capable_hwtcl 4
set_component_parameter_value pf6_msi_multi_message_capable_hwtcl 4
set_component_parameter_value pf7_msi_multi_message_capable_hwtcl 4
set_component_parameter_value pf_enable_function_msix_support_hwtcl 0
set_component_parameter_value vf_msix_cap_present_hwtcl 0
set_component_parameter_value pf0_msix_table_size_hwtcl 0
set_component_parameter_value pf0_msix_table_offset_hwtcl 0
set_component_parameter_value pf0_msix_table_bir_hwtcl 0
set_component_parameter_value pf0_msix_pba_offset_hwtcl 0
set_component_parameter_value pf0_msix_pba_bir_hwtcl 0
set_component_parameter_value pf1_msix_table_size_hwtcl 0
set_component_parameter_value pf1_msix_table_offset_hwtcl 0
set_component_parameter_value pf1_msix_table_bir_hwtcl 0
set_component_parameter_value pf1_msix_pba_offset_hwtcl 0
set_component_parameter_value pf1_msix_pba_bir_hwtcl 0
set_component_parameter_value pf2_msix_table_size_hwtcl 0
set_component_parameter_value pf2_msix_table_offset_hwtcl 0
set_component_parameter_value pf2_msix_table_bir_hwtcl 0
set_component_parameter_value pf2_msix_pba_offset_hwtcl 0
set_component_parameter_value pf2_msix_pba_bir_hwtcl 0
set_component_parameter_value pf3_msix_table_size_hwtcl 0
set_component_parameter_value pf3_msix_table_offset_hwtcl 0
set_component_parameter_value pf3_msix_table_bir_hwtcl 0
set_component_parameter_value pf3_msix_pba_offset_hwtcl 0
set_component_parameter_value pf3_msix_pba_bir_hwtcl 0
set_component_parameter_value pf4_msix_table_size_hwtcl 0
set_component_parameter_value pf4_msix_table_offset_hwtcl 0
set_component_parameter_value pf4_msix_table_bir_hwtcl 0
set_component_parameter_value pf4_msix_pba_offset_hwtcl 0
set_component_parameter_value pf4_msix_pba_bir_hwtcl 0
set_component_parameter_value pf5_msix_table_size_hwtcl 0
set_component_parameter_value pf5_msix_table_offset_hwtcl 0
set_component_parameter_value pf5_msix_table_bir_hwtcl 0
set_component_parameter_value pf5_msix_pba_offset_hwtcl 0
set_component_parameter_value pf5_msix_pba_bir_hwtcl 0
set_component_parameter_value pf6_msix_table_size_hwtcl 0
set_component_parameter_value pf6_msix_table_offset_hwtcl 0
set_component_parameter_value pf6_msix_table_bir_hwtcl 0
set_component_parameter_value pf6_msix_pba_offset_hwtcl 0
set_component_parameter_value pf6_msix_pba_bir_hwtcl 0
set_component_parameter_value pf7_msix_table_size_hwtcl 0
set_component_parameter_value pf7_msix_table_offset_hwtcl 0
set_component_parameter_value pf7_msix_table_bir_hwtcl 0
set_component_parameter_value pf7_msix_pba_offset_hwtcl 0
set_component_parameter_value pf7_msix_pba_bir_hwtcl 0
set_component_parameter_value pf0_vf_msix_tbl_size_hwtcl 0
set_component_parameter_value pf0_vf_msix_tbl_offset_hwtcl 0
set_component_parameter_value pf0_vf_msix_tbl_bir_hwtcl 0
set_component_parameter_value pf0_vf_msix_pba_offset_hwtcl 0
set_component_parameter_value pf0_vf_msix_pba_bir_hwtcl 0
set_component_parameter_value pf1_vf_msix_tbl_size_hwtcl 0
set_component_parameter_value pf1_vf_msix_tbl_offset_hwtcl 0
set_component_parameter_value pf1_vf_msix_tbl_bir_hwtcl 0
set_component_parameter_value pf1_vf_msix_pba_offset_hwtcl 0
set_component_parameter_value pf1_vf_msix_pba_bir_hwtcl 0
set_component_parameter_value pf2_vf_msix_tbl_size_hwtcl 0
set_component_parameter_value pf2_vf_msix_tbl_offset_hwtcl 0
set_component_parameter_value pf2_vf_msix_tbl_bir_hwtcl 0
set_component_parameter_value pf2_vf_msix_pba_offset_hwtcl 0
set_component_parameter_value pf2_vf_msix_pba_bir_hwtcl 0
set_component_parameter_value pf3_vf_msix_tbl_size_hwtcl 0
set_component_parameter_value pf3_vf_msix_tbl_offset_hwtcl 0
set_component_parameter_value pf3_vf_msix_tbl_bir_hwtcl 0
set_component_parameter_value pf3_vf_msix_pba_offset_hwtcl 0
set_component_parameter_value pf3_vf_msix_pba_bir_hwtcl 0
set_component_parameter_value pf0_interrupt_pin_hwtcl inta
set_component_parameter_value pf1_interrupt_pin_hwtcl inta
set_component_parameter_value pf2_interrupt_pin_hwtcl inta
set_component_parameter_value pf3_interrupt_pin_hwtcl inta
set_component_parameter_value pf4_interrupt_pin_hwtcl inta
set_component_parameter_value pf5_interrupt_pin_hwtcl inta
set_component_parameter_value pf6_interrupt_pin_hwtcl inta
set_component_parameter_value pf7_interrupt_pin_hwtcl inta
set_component_parameter_value pf0_intr_line_hwtcl 0
set_component_parameter_value pf1_intr_line_hwtcl 0
set_component_parameter_value pf2_intr_line_hwtcl 0
set_component_parameter_value pf3_intr_line_hwtcl 0
set_component_parameter_value pf4_intr_line_hwtcl 0
set_component_parameter_value pf5_intr_line_hwtcl 0
set_component_parameter_value pf6_intr_line_hwtcl 0
set_component_parameter_value pf7_intr_line_hwtcl 0
set_component_parameter_value link2csr_width_hwtcl 16
set_component_parameter_value test_cseb_switch_hwtcl 0
